# EAGLE design BadgeBoard (EAGLE 7.6.0)
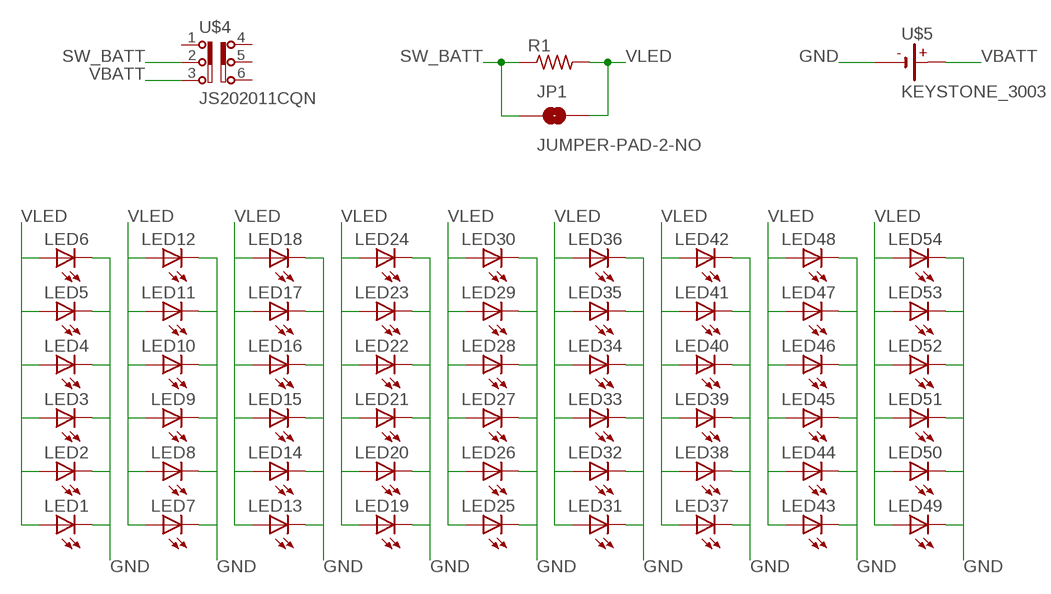
[diagram p0: schematic, sheet 1]

## Parts
JP1  JUMPER-PAD-2-NO  [PAD-JUMPER-2-NO_NO_SILK]
LED1  LED3MM  [LED3MM]
LED2  LED3MM  [LED3MM]
LED3  LED3MM  [LED3MM]
LED4  LED3MM  [LED3MM]
LED5  LED3MM  [LED3MM]
LED6  LED3MM  [LED3MM]
LED7  LED3MM  [LED3MM]
LED8  LED3MM  [LED3MM]
LED9  LED3MM  [LED3MM]
LED10  LED3MM  [LED3MM]
LED11  LED3MM  [LED3MM]
LED12  LED3MM  [LED3MM]
LED13  LED3MM  [LED3MM]
LED14  LED3MM  [LED3MM]
LED15  LED3MM  [LED3MM]
LED16  LED3MM  [LED3MM]
LED17  LED3MM  [LED3MM]
LED18  LED3MM  [LED3MM]
LED19  LED3MM  [LED3MM]
LED20  LED3MM  [LED3MM]
LED21  LED3MM  [LED3MM]
LED22  LED3MM  [LED3MM]
LED23  LED3MM  [LED3MM]
LED24  LED3MM  [LED3MM]
LED25  LED3MM  [LED3MM]
LED26  LED3MM  [LED3MM]
LED27  LED3MM  [LED3MM]
LED28  LED3MM  [LED3MM]
LED29  LED3MM  [LED3MM]
LED30  LED3MM  [LED3MM]
LED31  LED3MM  [LED3MM]
LED32  LED3MM  [LED3MM]
LED33  LED3MM  [LED3MM]
LED34  LED3MM  [LED3MM]
LED35  LED3MM  [LED3MM]
LED36  LED3MM  [LED3MM]
LED37  LED3MM  [LED3MM]
LED38  LED3MM  [LED3MM]
LED39  LED3MM  [LED3MM]
LED40  LED3MM  [LED3MM]
LED41  LED3MM  [LED3MM]
LED42  LED3MM  [LED3MM]
LED43  LED3MM  [LED3MM]
LED44  LED3MM  [LED3MM]
LED45  LED3MM  [LED3MM]
LED46  LED3MM  [LED3MM]
LED47  LED3MM  [LED3MM]
LED48  LED3MM  [LED3MM]
LED49  LED3MM  [LED3MM]
LED50  LED3MM  [LED3MM]
LED51  LED3MM  [LED3MM]
LED52  LED3MM  [LED3MM]
LED53  LED3MM  [LED3MM]
LED54  LED3MM  [LED3MM]
R1  R-US_0207/9  [0207/9]
U$4  JS202011CQN  [JS202011CQN]
U$5  KEYSTONE_3003  [KEYSTONE_3003]

## Nets
GND: LED1.K(C) LED2.K(C) LED3.K(C) LED4.K(C) LED5.K(C) LED6.K(C) LED7.K(C) LED8.K(C) LED9.K(C) LED10.K(C) LED11.K(C) LED12.K(C) LED13.K(C) LED14.K(C) LED15.K(C) LED16.K(C) LED17.K(C) LED18.K(C) LED19.K(C) LED20.K(C) LED21.K(C) LED22.K(C) LED23.K(C) LED24.K(C) LED25.K(C) LED26.K(C) LED27.K(C) LED28.K(C) LED29.K(C) LED30.K(C) LED31.K(C) LED32.K(C) LED33.K(C) LED34.K(C) LED35.K(C) LED36.K(C) LED37.K(C) LED38.K(C) LED39.K(C) LED40.K(C) LED41.K(C) LED42.K(C) LED43.K(C) LED44.K(C) LED45.K(C) LED46.K(C) LED47.K(C) LED48.K(C) LED49.K(C) LED50.K(C) LED51.K(C) LED52.K(C) LED53.K(C) LED54.K(C) U$5.P$3(-)
SW_BATT: JP1.1 R1.1 U$4.2
VBATT: U$4.3 U$5.P$1(+) U$5.P$2(+)
VLED: JP1.2 LED1.A LED2.A LED3.A LED4.A LED5.A LED6.A LED7.A LED8.A LED9.A LED10.A LED11.A LED12.A LED13.A LED14.A LED15.A LED16.A LED17.A LED18.A LED19.A LED20.A LED21.A LED22.A LED23.A LED24.A LED25.A LED26.A LED27.A LED28.A LED29.A LED30.A LED31.A LED32.A LED33.A LED34.A LED35.A LED36.A LED37.A LED38.A LED39.A LED40.A LED41.A LED42.A LED43.A LED44.A LED45.A LED46.A LED47.A LED48.A LED49.A LED50.A LED51.A LED52.A LED53.A LED54.A R1.2
Unconnected: U$4.1 U$4.4 U$4.5 U$4.6

## Library data of the parts
JP1 = SparkFun-Passives:JUMPER-PAD-2-NO
LED1-LED54 = adafruit:LED: LED OSRAM: - CHIPLED LG R971, LG N971, LY N971, LG Q971, LY Q971, LO R971, LY R971 LH N974, LH R974 LS Q976, LO Q976, LY Q976 LO Q996 - Hyper CHIPLED LW Q18S LB Q993, LB Q99A, LB R99A - SideLED LS A670, LO A670, LY A670, LG A670, LP A670 LB A673, LV A673, LT A673, LW A673 LH A674 LY A675 LS A676, LA A676, LO A676, LY A676, LW A676 LS A679, LY A679, LG A679 - Hyper Micro SIDELED® LS Y876, LA Y876, LO Y876, LY Y876 LT Y87S - SmartLED LW L88C, LW L88S LB L89C, LB L89S, LG L890 LS L89K, LO L89K, LY L89K LS L896, LA L896, LO L896, LY L896 - TOPLED LS T670, LO T670, LY T670, LG T670, LP T670 LSG T670, LSP T670, LSY T670, LOP T670, LYG T670 LG T671, LOG T671, LSG T671 LB T673, LV T673, LT T673, LW T673 LH T674 LS T676, LA T676, LO T676, LY T676, LB T676, LH T676, LSB T676, LW T676 LB T67C, LV T67C, LT T67C, LS T67K, LO T67K, LY T67K, LW E67C LS E67B, LA E67B, LO E67B, LY E67B, LB E67C, LV E67C, LT E67C LW T67C LS T679, LY T679, LG T679 LS T770, LO T770, LY T770, LG T770, LP T770 LB T773, LV T773, LT T773, LW T773 LH T774 LS E675, LA E675, LY E675, LS T675 LS T776, LA T776, LO T776, LY T776, LB T776 LHGB T686 LT T68C, LB T68C - Hyper Mini TOPLED® LB M676 - Mini TOPLED Santana® LG M470 LS M47K, LO M47K, LY M47K Source: http://www.osram.convergy.de/
R1 = adafruit:R-US_: RESISTOR, American symbol
U$4 = switch:JS202011CQN: DPDT through hole slide switch
U$5 = battery:KEYSTONE_3003: Keystone 3003 20mm coin cell battery clip

## Board
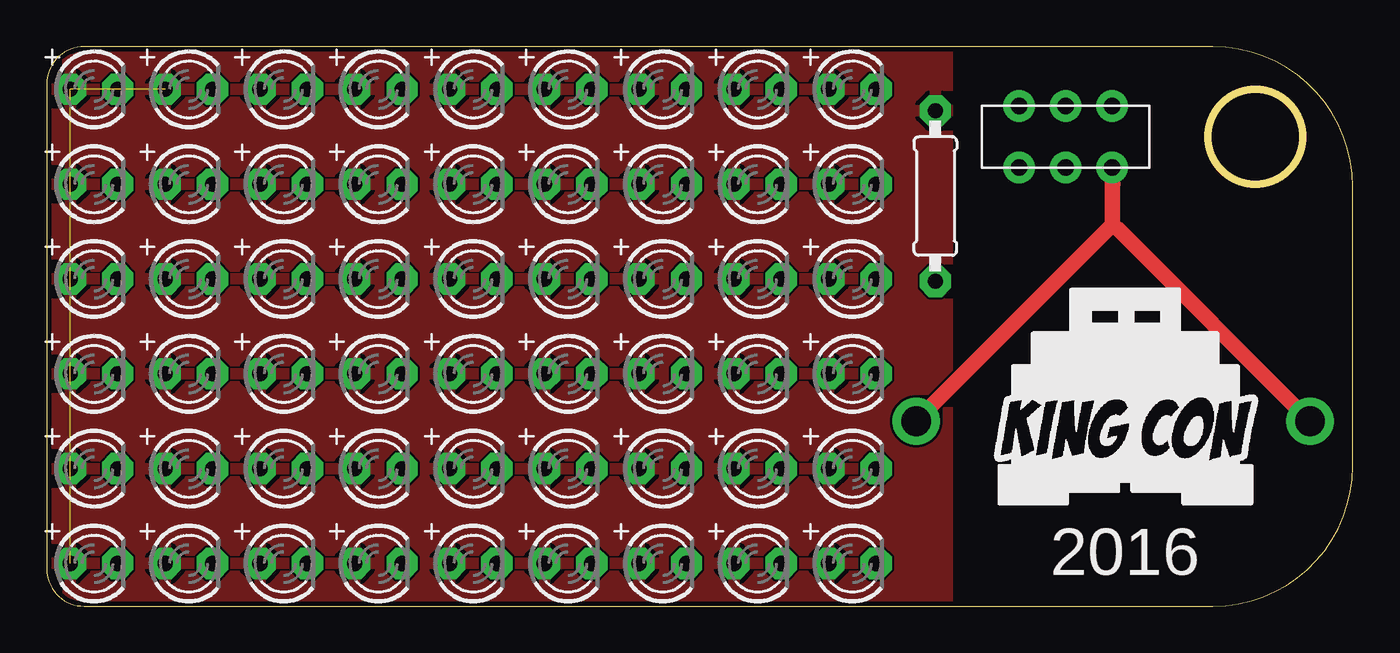
[diagram p1: board, top side]
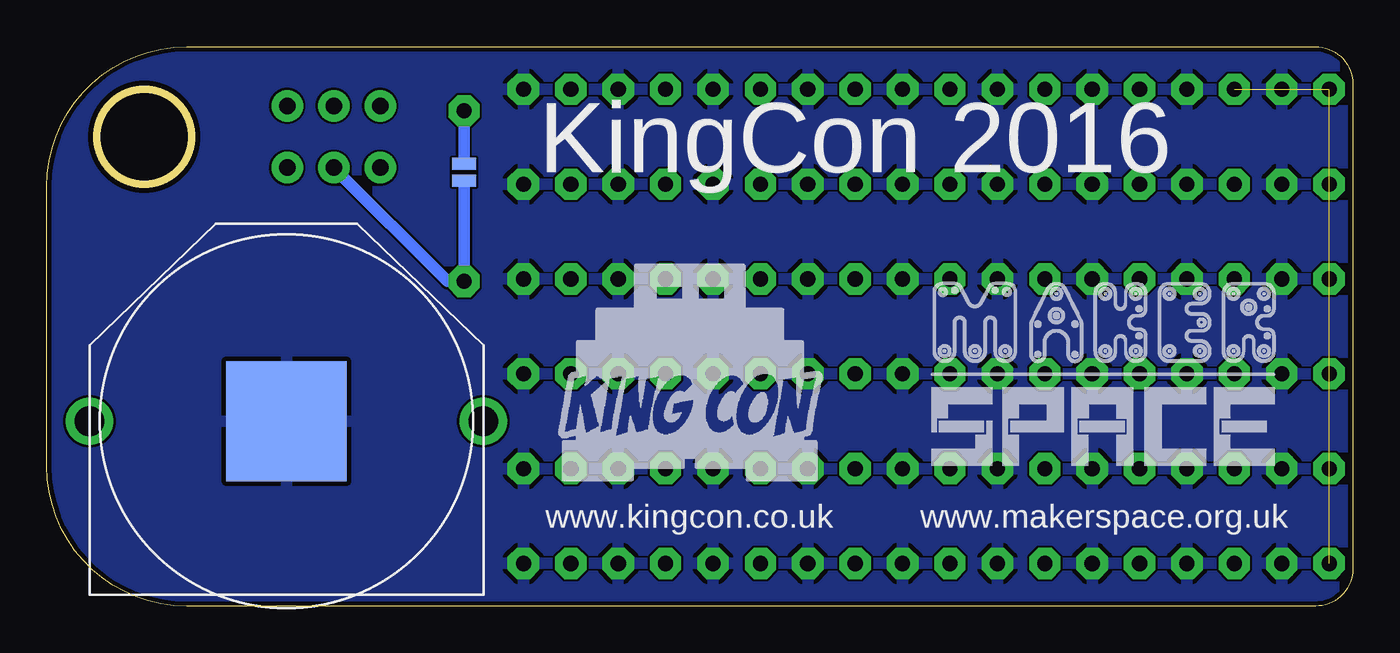
[diagram p2: board, bottom side, seen from below]

Size 70 x 29.97 mm. Coordinates in mm from the lower left corner, seen from the top.
Outline: 62.5,29.97 2,29.97 arc90 0,27.97 0,2 arc90 2,0 62.5,0 arc90 70,7.5 70,22.47 arc90 62.5,29.97
Outline: circle at 64.77,25.15 radius 2.54
Copper layers (1*16): Top 0.035mm / dielectric 1.5mm / Bottom 0.035mm
Design rules "dirt_cheap_dirty_boards.v1": minimum track width 5mil, minimum drill 12mil, track to track 5mil, track to pad 5mil, pad to pad 5mil, via to via 5mil, smd to smd 0mil, copper to edge 10mil, drill to drill 10mil, minimum pad ring 10mil, minimum via ring 6mil, stop-mask expansion 2mil, vias tented up to drill 25mil, thermal gap 10mil

### Footprints (pad centres in the part's own frame; a part is rotated, then mirrored left to right if it is on the bottom)
PAD-JUMPER-2-NO_NO_SILK = smd 0.635 x 1.27: 1 -0.45,0; 2 0.45,0
LED3MM = drill 0.813 pad 1.676 octagon: A -1.27,0; K 1.27,0
0207/9 = drill 0.813 pad 1.676 octagon: 1 -4.572,0; 2 4.572,0
JS202011CQN = drill 0.9 pad 1.676: 1 -2.489,-1.651; 2 0,-1.651; 3 2.489,-1.651; 4 -2.489,1.651; 5 0,1.651; 6 2.489,1.651
KEYSTONE_3003 = drill 1.6 pad 2.54: P$1 -10.554,0; P$2 10.554,0 | smd 6.452 x 6.452: P$3 0,0

### Placement (x,y rotation side)
JP1  47.62,23.24 90 bottom
LED1  2.54,2.29 0 top
LED2  2.54,7.37 0 top
LED3  2.54,12.45 0 top
LED4  2.54,17.53 0 top
LED5  2.54,22.61 0 top
LED6  2.54,27.69 0 top
LED7  7.62,2.29 0 top
LED8  7.62,7.37 0 top
LED9  12.7,2.29 0 top
LED10  7.62,22.61 0 top
LED11  22.86,2.29 0 top
LED12  7.62,12.45 0 top
LED13  17.78,2.29 0 top
LED14  7.62,27.69 0 top
LED15  7.62,17.53 0 top
LED16  12.7,7.37 0 top
LED17  12.7,12.45 0 top
LED18  22.86,27.69 0 top
LED19  12.7,17.53 0 top
LED20  12.7,22.61 0 top
LED21  12.7,27.69 0 top
LED22  22.86,22.61 0 top
LED23  22.86,17.53 0 top
LED24  22.86,12.45 0 top
LED25  22.86,7.37 0 top
LED26  17.78,27.69 0 top
LED27  17.78,22.61 0 top
LED28  17.78,17.53 0 top
LED29  17.78,12.45 0 top
LED30  17.78,7.37 0 top
LED31  38.1,27.69 0 top
LED32  33.02,22.61 0 top
LED33  27.94,27.69 0 top
LED34  38.1,22.61 0 top
LED35  33.02,17.53 0 top
LED36  27.94,22.61 0 top
LED37  38.1,17.53 0 top
LED38  33.02,12.45 0 top
LED39  27.94,17.53 0 top
LED40  38.1,12.45 0 top
LED41  33.02,7.37 0 top
LED42  27.94,12.45 0 top
LED43  38.1,7.37 0 top
LED44  33.02,2.29 0 top
LED45  27.94,7.37 0 top
LED46  38.1,2.29 0 top
LED47  33.02,27.69 0 top
LED48  27.94,2.29 0 top
LED49  43.18,27.69 0 top
LED50  43.18,22.61 0 top
LED51  43.18,17.53 0 top
LED52  43.18,7.37 0 top
LED53  43.18,2.29 0 top
LED54  43.18,12.45 0 top
R1  47.62,21.97 90 top
U$1  [KINGCON_LOGO_L]  50.16,3.56 0 top
U$2  [MAKERSPACE_LOGO_FULL_M]  22.86,7.37 0 bottom
U$3  [KINGCON_LOGO_L]  43.18,4.83 0 bottom
U$4  54.61,25.15 0 top
U$5  57.15,9.91 180 bottom

### Tracks (layer width: path | path; a pad name or v marks a point on that pad's centre or on a via)
GND
  pour Bottom: 0,30.23 69.85,30.23 69.85,-0.25 0,-0.25
SW_BATT
  Bottom 0.61: JP1.1 R1.1 48.51,17.4 U$4.2
VBATT
  Top 0.813: 57.15,20.46 57.15,22.61 57.1,22.66 U$4.3 57.1,20.41 56.95,20.26 | 56.95,20.26 U$5.P$1 | U$5.P$2 57.35,20.26 56.95,20.26
VLED  (6 unrouted)
  Bottom 0.61: JP1.2 R1.2
  pour Top: 0,30.23 48.26,30.23 48.26,-0.25 0,-0.25

### Text on the board
tNames: 2016
bNames: KingCon 2016 | www.makerspace.org.uk | www.kingcon.co.uk